# Altium schematic sheet Power Stage.SchDoc
size 431 x 279 mm; Date: Not shown in title block; ApprovedBy: Not shown in title block; CheckedBy: Not shown in title block; Author: Not shown; CompanyName: Not shown in title block; DrawnBy: Bowen; Engineer: Not shown; Organization: Not shown in title block; Address1: Not shown in title block; Address2: Not shown in title block; Address3: Not shown in title block; Address4: Not shown in title block; DocumentNumber: 1; Revision: Use project parameter SCH_Rev; SheetNumber: 1; SheetTotal: 3; PageSetup: Record=PageOptions|CenterHorizontal=True|CenterVertical=True|PrintScale=1.00|XCorrection=1.00|YCorrection=1.00|PrintKind=0|BorderSize=5000000|LeftOffset=0|BottomOffset=0|Orientation=2|PaperLength=1000|PaperWidth=1000|Scale=100|PaperSource=15|PrintQuality=600|MediaType=1|DitherType=10|PaperKind=Letter|PrintScaleMode=1; CurrentTime: Not shown in title block; CurrentDate: Not shown in title block; Time: Not shown in title block; DocumentFullPathAndName: Not shown in title block; DocumentName: Not shown in title block; ModifiedDate: 1/25/2022; ImagePath: Not shown in title block
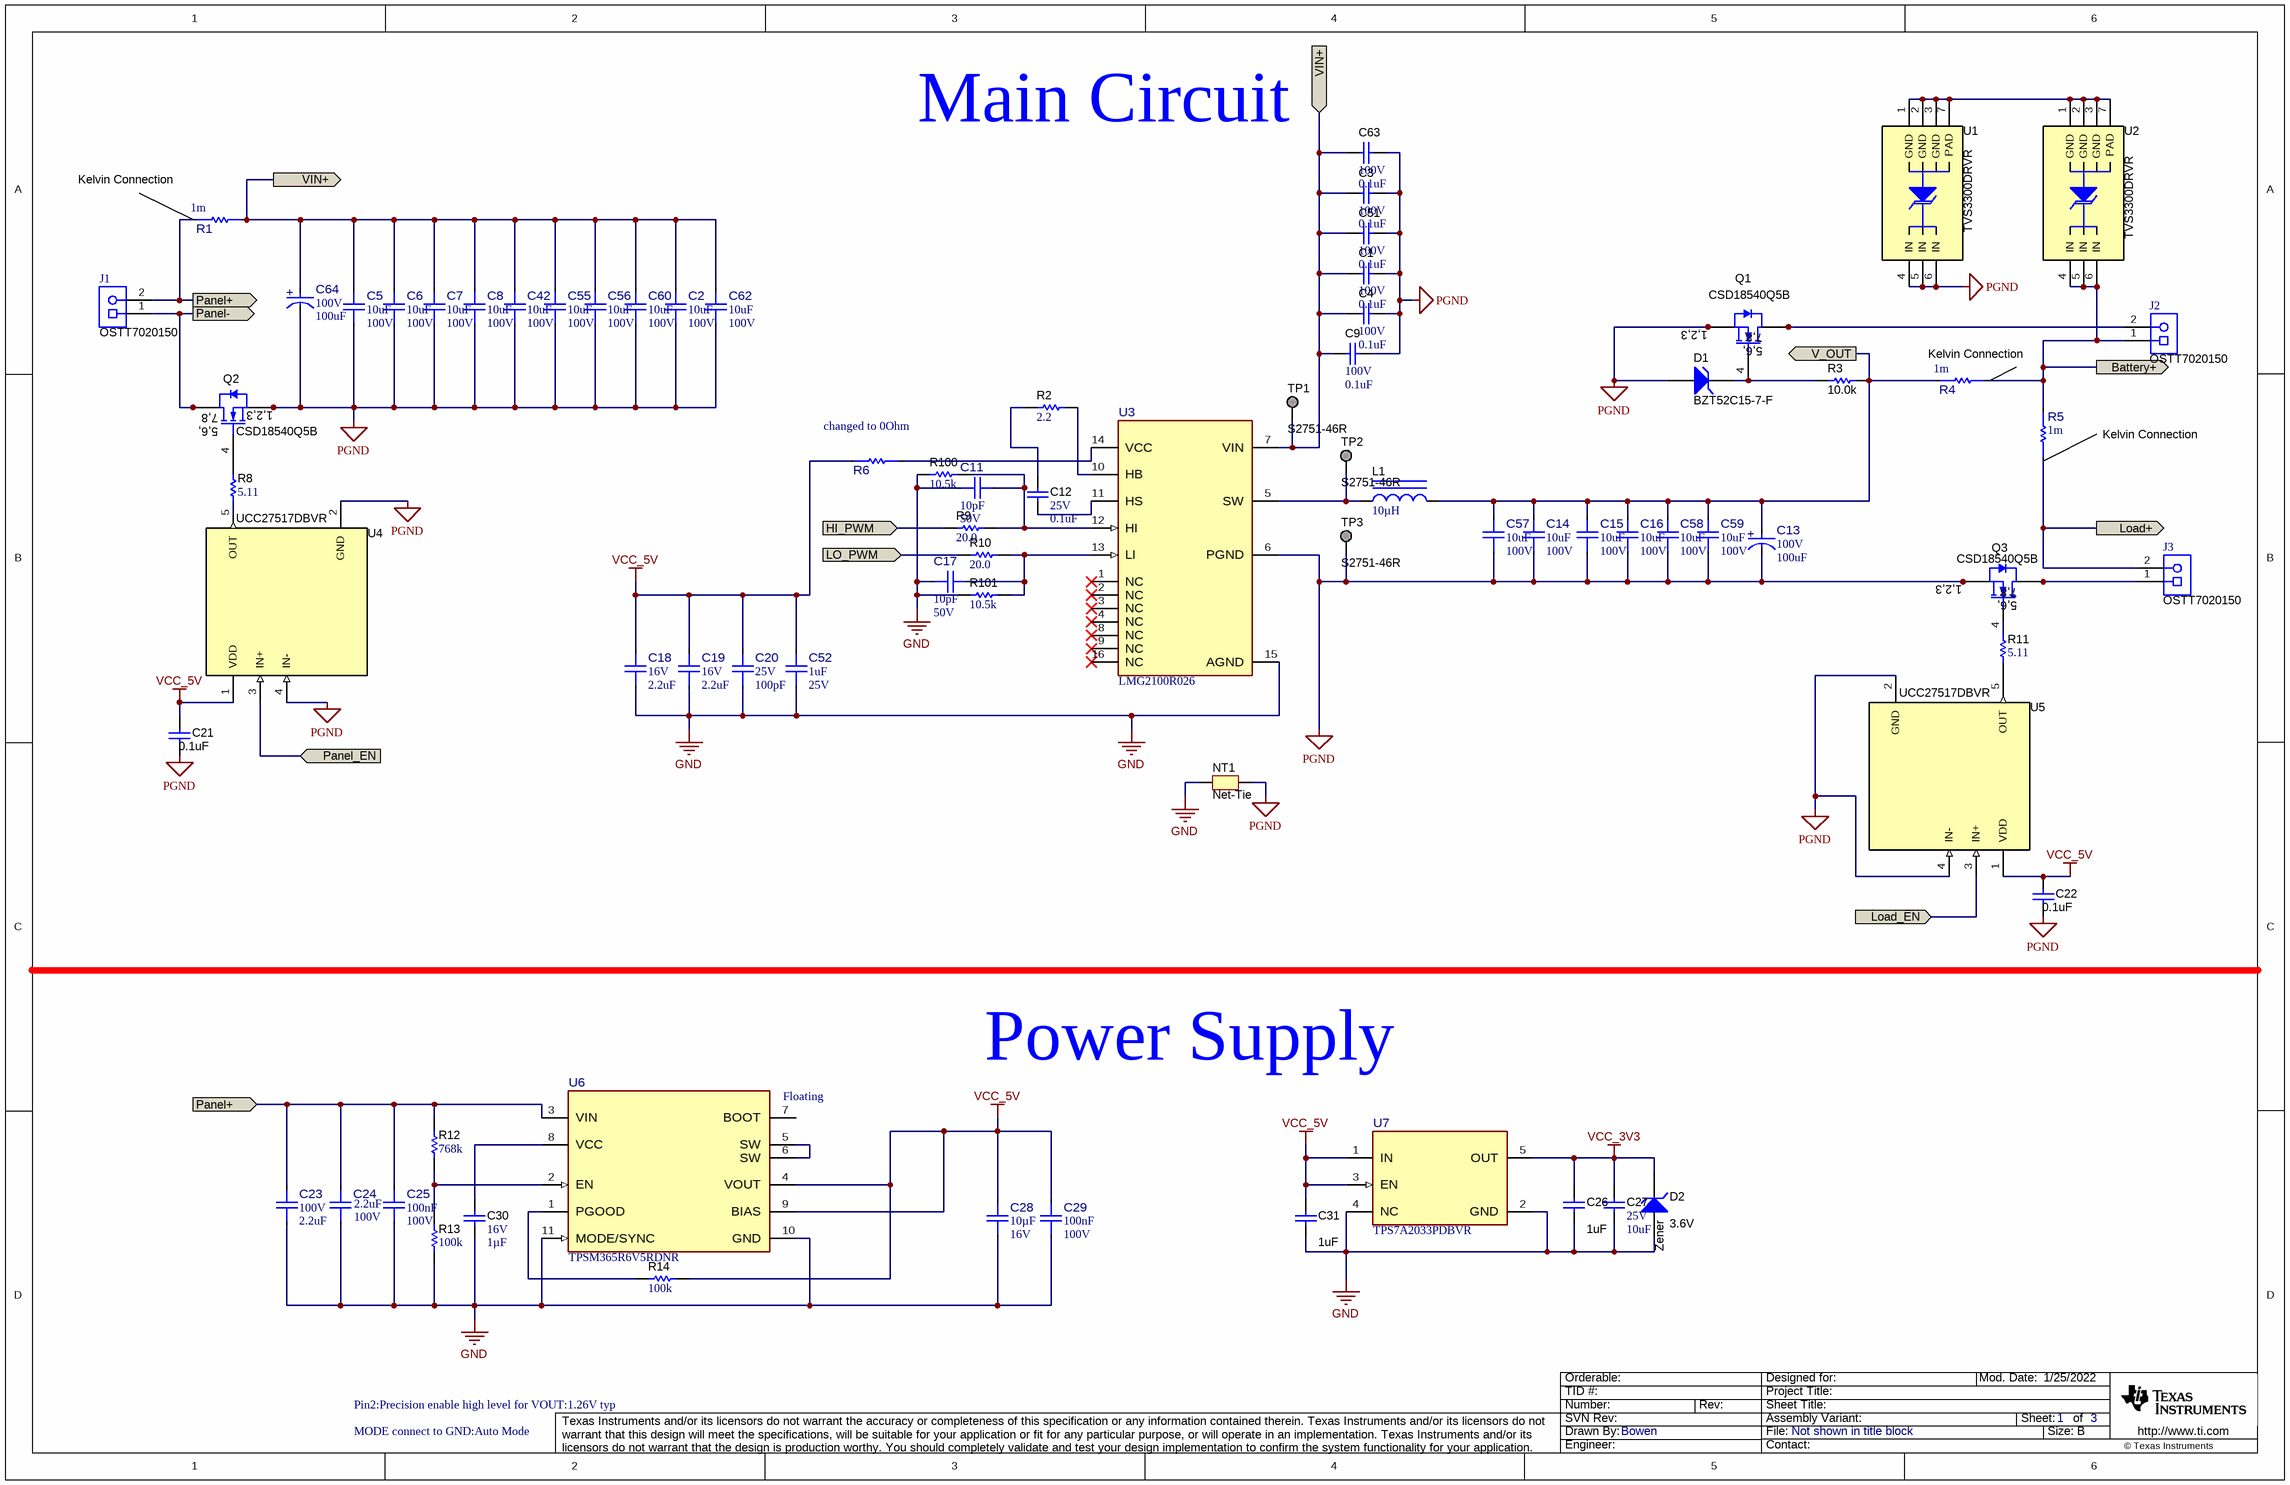
[diagram p0: Power Stage.SchDoc]

## Parts
C1  VDC_V: 100V  ValueDisplayed: 0.1uF  [0402S]  (hidden comment: GRM155R62A104KE14D)
C2  ValueDisplayed: 10uF  VDC_V: 100V  [FP-GRM32EC72A106KE05L_1210-MFG]  (hidden comment: GRM32EC72A106KE05L)
C3  VDC_V: 100V  ValueDisplayed: 0.1uF  [0402S]  (hidden comment: GRM155R62A104KE14D)
C4  VDC_V: 100V  ValueDisplayed: 0.1uF  [0402S]  (hidden comment: GRM155R62A104KE14D)
C5  ValueDisplayed: 10uF  VDC_V: 100V  [FP-GRM32EC72A106KE05L_1210-MFG]  (hidden comment: GRM32EC72A106KE05L)
C6  ValueDisplayed: 10uF  VDC_V: 100V  [FP-GRM32EC72A106KE05L_1210-MFG]  (hidden comment: GRM32EC72A106KE05L)
C7  ValueDisplayed: 10uF  VDC_V: 100V  [FP-GRM32EC72A106KE05L_1210-MFG]  (hidden comment: GRM32EC72A106KE05L)
C8  ValueDisplayed: 10uF  VDC_V: 100V  [FP-GRM32EC72A106KE05L_1210-MFG]  (hidden comment: GRM32EC72A106KE05L)
C9  VDC_V: 100V  ValueDisplayed: 0.1uF  [0402S]  (hidden comment: GRM155R62A104KE14D)
C11  ValueDisplayed: 10pF  VDC_V: 50V  [FP-04025U100FAT2A_0402-MFG]  (hidden comment: 04025U100FAT2A)
C12  VDC_V: 25V  ValueDisplayed: 0.1uF  [0402S]  (hidden comment: GRM155R71E104KE14D)
C13  VDC_V: 100V  ValueDisplayed: 100uF  [FP-ESY476M100AH1AA_RADIAL-MFG]  (hidden comment: ESY107M100AH5)
C14  ValueDisplayed: 10uF  VDC_V: 100V  [FP-GRM32EC72A106KE05L_1210-MFG]  (hidden comment: GRM32EC72A106KE05L)
C15  ValueDisplayed: 10uF  VDC_V: 100V  [FP-GRM32EC72A106KE05L_1210-MFG]  (hidden comment: GRM32EC72A106KE05L)
C16  ValueDisplayed: 10uF  VDC_V: 100V  [FP-GRM32EC72A106KE05L_1210-MFG]  (hidden comment: GRM32EC72A106KE05L)
C17  ValueDisplayed: 10pF  VDC_V: 50V  [FP-04025U100FAT2A_0402-MFG]  (hidden comment: 04025U100FAT2A)
C18  VDC_V: 16V  ValueDisplayed: 2.2uF  [FP-GRM188C71C225KE11D_0603-MFG]  (hidden comment: GRM188C71C225KE11D)
C19  VDC_V: 16V  ValueDisplayed: 2.2uF  [FP-GRM188C71C225KE11D_0603-MFG]  (hidden comment: GRM188C71C225KE11D)
C20  VDC_V: 25V  ValueDisplayed: 100pF  [FP-GRT1555C1E101JA02D_0402-MFG]  (hidden comment: GRT1555C1E101JA02D)
C21  ValueDisplayed: 0.1uF  [0603]  (hidden comment: GMK107BJ104KAHT)
C22  ValueDisplayed: 0.1uF  [0603]  (hidden comment: GMK107BJ104KAHT)
C23  VDC_V: 100V  ValueDisplayed: 2.2uF  [FP-12061C225KAT2A_1206-MFG]  (hidden comment: 12061C225KAT2A)
C24  VDC_V: 100V  ValueDisplayed: 2.2uF  [FP-12061C225KAT2A_1206-MFG]  (hidden comment: 12061C225KAT2A)
C25  Cap_F: 100nF  VDC_V: 100V  [FP-GRM188R72A104KA35D_0603-MFG]  (hidden comment: GRM188R72A104KA35D)
C26  ValueDisplayed: 1uF  [0603]  (hidden comment: C1608X7R1E105K080AB)
C27  VDC_V: 25V  ValueDisplayed: 10uF  [1206_180]  (hidden comment: GRM31CR71E106KA12L)
C28  Cap_F: 10µF  VDC_V: 16V  [FP-CL21B106KOQNNNG_0805-MFG]  (hidden comment: CL21B106KOQNNNG)
C29  Cap_F: 100nF  VDC_V: 100V  [FP-GRM188R72A104KA35D_0603-MFG]  (hidden comment: GRM188R72A104KA35D)
C30  VDC_V: 16V  Cap_F: 1µF  [0603]  (hidden comment: CL10B105KO8VPNC)
C31  ValueDisplayed: 1uF  [0603]  (hidden comment: C1608X7R1E105K080AB)
C42  ValueDisplayed: 10uF  VDC_V: 100V  [FP-GRM32EC72A106KE05L_1210-MFG]  (hidden comment: GRM32EC72A106KE05L)
C51  VDC_V: 100V  ValueDisplayed: 0.1uF  [0402S]  (hidden comment: GRM155R62A104KE14D)
C52  ValueDisplayed: 1uF  VDC_V: 25V  [FP-GRT155R61E105KE01D_0402-MFG]  (hidden comment: GRT155R61E105KE01D)
C55  ValueDisplayed: 10uF  VDC_V: 100V  [FP-GRM32EC72A106KE05L_1210-MFG]  (hidden comment: GRM32EC72A106KE05L)
C56  ValueDisplayed: 10uF  VDC_V: 100V  [FP-GRM32EC72A106KE05L_1210-MFG]  (hidden comment: GRM32EC72A106KE05L)
C57  ValueDisplayed: 10uF  VDC_V: 100V  [FP-GRM32EC72A106KE05L_1210-MFG]  (hidden comment: GRM32EC72A106KE05L)
C58  ValueDisplayed: 10uF  VDC_V: 100V  [FP-GRM32EC72A106KE05L_1210-MFG]  (hidden comment: GRM32EC72A106KE05L)
C59  ValueDisplayed: 10uF  VDC_V: 100V  [FP-GRM32EC72A106KE05L_1210-MFG]  (hidden comment: GRM32EC72A106KE05L)
C60  ValueDisplayed: 10uF  VDC_V: 100V  [FP-GRM32EC72A106KE05L_1210-MFG]  (hidden comment: GRM32EC72A106KE05L)
C62  ValueDisplayed: 10uF  VDC_V: 100V  [FP-GRM32EC72A106KE05L_1210-MFG]  (hidden comment: GRM32EC72A106KE05L)
C63  VDC_V: 100V  ValueDisplayed: 0.1uF  [0402S]  (hidden comment: GRM155R62A104KE14D)
C64  VDC_V: 100V  ValueDisplayed: 100uF  [FP-ESY476M100AH1AA_RADIAL-MFG]  (hidden comment: ESY107M100AH5)
D1  BZT52C15-7-F  [SOD-123]
D2  Zener  value 3.6V  [SOD-123]
J1  OSTT7020150  [On-Shore_OSTT7020150]
J2  OSTT7020150  [On-Shore_OSTT7020150]
J3  OSTT7020150  [On-Shore_OSTT7020150]
L1  ValueDisplayed: 10µH  [WE-HCF_2818]  (hidden comment: 7443641000)
NT1  Net-Tie  [Net-Tie_0805_HV_NoOverlay]  (net tie, no BOM)
Q1  CSD18540Q5B  [DNK0008A]
Q2  CSD18540Q5B  [DNK0008A]
Q3  CSD18540Q5B  [DNK0008A]
R1  value 1m  [FP-ULRG32512R001FLFSLT_2512-MFG]  (hidden comment: ULRG32512R001FLFSLT)
R2  ValueDisplayed: 2.2  [0402S]  (hidden comment: CRCW04022R20JNED)
R3  ValueDisplayed: 10.0k  [0603]  (hidden comment: Resistor)
R4  value 1m  [FP-ULRG32512R001FLFSLT_2512-MFG]  (hidden comment: ULRG32512R001FLFSLT)
R5  value 1m  [FP-ULRG32512R001FLFSLT_2512-MFG]  (hidden comment: ULRG32512R001FLFSLT)
R6  RCG04020000Z0ED  [FP-RCG04020000Z0ED_0402-MFG]  (value not drawn)
R8  value 5.11  [1206]  (hidden comment: CRCW12065R11FKEA)
R9  ValueDisplayed: 20.0  [0603]  (hidden comment: RC0603FR-0720RL)
R10  ValueDisplayed: 20.0  [0603]  (hidden comment: RC0603FR-0720RL)
R11  value 5.11  [1206]  (hidden comment: CRCW12065R11FKEA)
R12  ValueDisplayed: 768k  [0603]  (hidden comment: RC0603FR-07768KL)
R13  ValueDisplayed: 100k  [0603]  (hidden comment: RC0603FR-07100KL)
R14  ValueDisplayed: 100k  [0402]  (hidden comment: RC0402FR-07100KL)
R100  ValueDisplayed: 10.5k  [0402S]  (hidden comment: RC0402FR-0710K5L)
R101  ValueDisplayed: 10.5k  [0402S]  (hidden comment: RC0402FR-0710K5L)
TP1  S2751-46R  [Harwin_S2751-46R]  (no BOM)
TP2  S2751-46R  [Harwin_S2751-46R]  (no BOM)
TP3  S2751-46R  [Harwin_S2751-46R]  (no BOM)
U1  TVS3300DRVR  [DRV0006A]
U2  TVS3300DRVR  [DRV0006A]
U3  LMG2100R026  [VBN0016A-MFG]
U4  UCC27517DBVR  [DBV0005A_N]
U5  UCC27517DBVR  [DBV0005A_N]
U6  TPSM365R6V5RDNR  [RDN0011A-MFG]
U7  TPS7A2033PDBVR  [DBV0005A-MFG]

## Ports
Battery+ (out), HI_PWM (in), LO_PWM (in), Load+ (out), Load_EN (in), Panel+ (in), Panel+ (out), Panel- (out), Panel_EN (in), V_OUT (out), VIN+ (in), VIN+ (out)

## Nets
GND: C11.1 C17.1 C18.1 C19.1 C20.1 C23.1 C24.1 C25.1 C26.2 C27.2 C28.1 C29.1 C30.2 C31.2 C52.1 D2.2(A) NT1.1 R13.1 R100.2 R101.2 U3.15(AGND) U6.10(GND) U6.11(MODE/SYNC) U7.2(GND) U7.4(NC)
PGND: C1.1 C2.1 C3.1 C4.1 C5.1 C6.1 C7.1 C8.1 C9.1 C13.1(CATHODE) C14.1 C15.1 C16.1 C21.2 C22.2 C42.1 C51.1 C55.1 C56.1 C57.1 C58.1 C59.1 C60.1 C62.1 C63.1 C64.1(CATHODE) D1.2(A) NT1.2 Q1.1(S) Q1.2(S) Q1.3(S) Q2.1(S) Q2.2(S) Q2.3(S) Q3.1(S) Q3.2(S) Q3.3(S) TP3.1 U1.4(IN) U1.5(IN) U1.6(IN) U3.6(PGND) U4.2(GND) U4.4(IN-) U5.2(GND) U5.4(IN-)
VCC_3V3: C26.1 C27.1 D2.1(K) U7.5(OUT)
VCC_5V: C18.2 C19.2 C20.2 C21.1 C22.1 C28.2 C29.2 C31.1 C52.2 R6.1 R14.2 U4.1(VDD) U5.1(VDD) U6.4(VOUT) U6.9(BIAS) U7.1(IN) U7.3(EN)
Battery+: J2.1 R4.2 R5.2 U2.4(IN) U2.5(IN) U2.6(IN) ; port Battery+
HI_PWM: R9.1 ; port HI_PWM
LO_PWM: R10.1 ; port LO_PWM
Load+: J3.2 R5.1 ; port Load+
Load_EN: U5.3(IN+) ; port Load_EN
Panel+: C23.2 C24.2 C25.2 J1.2 R1.1 R12.2 U6.3(VIN) ; port Panel+
Panel-: J1.1 Q2.5(D) Q2.6(D) Q2.7(D) Q2.8(D) Q2.9(D) ; port Panel-
Panel_EN: U4.3(IN+) ; port Panel_EN
V_OUT: C13.2(ANODE) C14.2 C15.2 C16.2 C57.2 C58.2 C59.2 L1.2 R3.2 R4.1 ; port V_OUT
VIN+: C1.2 C2.2 C3.2 C4.2 C5.2 C6.2 C7.2 C8.2 C9.2 C42.2 C51.2 C55.2 C56.2 C60.2 C62.2 C63.2 C64.2(ANODE) R1.2 TP1.1 U3.7(VIN) ; port VIN+
NetC11_2: C11.2 R9.2 R100.1 U3.12(HI)
NetC12_1: C12.1 R2.1
NetC12_2: C12.2 U3.11(HS)
NetC17_2: C17.2 R10.2 R101.1 U3.13(LI)
NetC30_1: C30.1 U6.8(VCC)
NetD1_1: D1.1(K) Q1.4(G) R3.1
NetJ2_2: J2.2 Q1.5(D) Q1.6(D) Q1.7(D) Q1.8(D) Q1.9(D)
NetJ3_1: J3.1 Q3.5(D) Q3.6(D) Q3.7(D) Q3.8(D) Q3.9(D)
NetL1_1: L1.1 TP2.1 U3.5(SW)
NetQ2_4: Q2.4(G) R8.2
NetQ3_4: Q3.4(G) R11.2
NetR2_2: R2.2 U3.10(HB)
NetR6_2: R6.2 U3.14(VCC)
NetR8_1: R8.1 U4.5(OUT)
NetR11_1: R11.1 U5.5(OUT)
NetR12_1: R12.1 R13.2 U6.2(EN)
NetR14_1: R14.1 U6.1(PGOOD)
NetU1_1: U1.1(GND) U1.2(GND) U1.3(GND) U1.7(PAD) U2.1(GND) U2.2(GND) U2.3(GND) U2.7(PAD)
NetU6_5: U6.5(SW) U6.6(SW)

Not connected (* = marked no-connect by the designer): U3 1(NC)* 2(NC)* 3(NC)* 4(NC)* 8(NC)* 9(NC)* 16(NC)*; U6 7(BOOT)

## Notes on the sheet
- (near C63) Main Circuit
- (near R1) Kelvin Connection
- (near R4) Kelvin Connection
- changed to 0Ohm
- Kelvin Connection
- (near U6) Floating
- Power Supply
- Pin2:Precision enable high level for VOUT:1.26V typ
- MODE connect to GND:Auto Mode
- Drawn By:
- SVN Rev:
- Number:
- TID #:
- Orderable:
- Rev:
- Sheet Title:
- File:
- Project Title:
- Designed for:
- Assembly Variant:
- Mod. Date:
- Sheet:
- Size:
- of
- B
- http://www.ti.com
- Texas Instruments and/or its licensors do not warrant the accuracy or completeness of this specification or any information contained therein. Texas Instruments and/or its licensors do not warrant that this design will meet the specifications, will be suitable for your application or fit for any particular purpose, or will operate in an implementation. Texas Instruments and/or its licensors do not warrant that the design is production worthy. You should completely validate and test your design implementation to confirm the system functionality for your application.
- Engineer:
- Contact:
- © Texas Instruments
- (in symbol CMP-0000823-2) 7,8; 1,2,3; 5,6,
- (in symbol CMP-0093719-1) +

## Library data of the parts
C1 C3 C4 C9 C51 C63 = CMP-0006618-2: CAP, CERM, 0.1 uF, 100 V, +/- 10%, X5R, 0402; Manufacturer: MuRata; TaMin_C: -55°C; Polarized: N; SizeAreaWB_mm2: 3; Value1: Unknown; U/M: EA; Value: 0.1uF; TaMax_C: 85°C; SizeZ_mm: 0.6; SizeX_mm: 1; SizeY_mm: 0.5; Cap_Case: 0402; Cap_F: 100nF; AEC Category: Q200; Supplier Part Number 2: 96Y9228; Publisher: Texas Instruments; Supplier 2: Newark; Supplier Part Number 3: 81-GRM155R62A104KE4D; TempCo: X5R; Supplier 3: Mouser; Published: 2008-06-19; RoHS: Y; MountType: SMT; Supplier 1: Digi-Key; PackageReference: 0402; Tolerance_%: 10%; Value2: 100V; SizeArea_mm2: 0.5; CompType: Capacitor; LatestRevisionDate: 2017-03-09; PartNumber: GRM155R62A104KE14D; AEC Qualified: N; ComponentLink1Description: Datasheet link; AEC Grade: N/A; Supplier Part Number 1: 490-10458-1-ND; Technology: Ceramic; ComponentLink1URL: http://psearch.en.murata.com/capacitor/product/GRM155R62A104KE14%23.pdf
C2 C5-C8 C14-C16 C42 C55-C60 C62 = CMP-0087970-1: 10µF ±10% 100V Ceramic Capacitor X7S 1210 (3225 Metric); Manufacturer: Murata; Symbol Name: SYM-GRM32EC72A106KE05L; Tolerance_%: 0.1; AEC Qualified: No; TempCo: 22%; SizeZ_mm: 2.7mm; RoHS: TRUE; ComponentLink1Description: Datasheet; ComponentLink1URL: https://search.murata.co.jp/Ceramy/image/img/A01X/G101/ENG/GRM32EC72A106KE05-01A.pdf; PackageReference: 1210; PartNumber: GRM32EC72A106KE05L; Cap_F: 10µF
C11 C17 = CMP-0097874-1: 10 pF ±1% 50V Ceramic Capacitor C0G, NP0 0402 (1005 Metric); Manufacturer: KYOCERA AVX; TempCo: 30ppm/°C; AEC Qualified: No; Value: 10pF; SizeZ_mm: 0.6mm; Part Number: 04025U100FAT2A; Temperature Characteristic: C0G; ComponentLink1URL: https://datasheets.kyocera-avx.com/U-Series.pdf; Mouser Description: Multilayer Ceramic Capacitors MLCC - SMD/SMT 50V 10pF C0G 0402 1%; Supplier 2: Mouser; Tolerance_%: 1%; ComponentLink1Description: Datasheet; Operating Temperature Range: -55°C to +125°C; Supplier Part Number 1: 478-5717-1-ND; Lead Free: Yes; Digikey Description: CAP CER 10PF 50V C0G/NP0 0402; RoHS: TRUE; Digikey Part Number: 478-5717-1-ND; Mouser Part Number: 581-04025U100FAT2A; Supplier 1: Digikey; Datasheet Path: datasheets/Cap-04025U100FAT2A.pdf; helpURL: https://upverter.com/upn/revision/fd3ee14ffddf53e3/; PackageReference: 0402; PartNumber: 04025U100FAT2A; datasheet: https://datasheets.kyocera-avx.com/U-Series.pdf; Cap_F: 10pF; Supplier Part Number 2: 581-04025U100FAT2A
C12 = CMP-0006659-2: CAP, CERM, 0.1 uF, 25 V, +/- 10%, X7R, 0402; Manufacturer: MuRata; TaMin_C: -55°C; Polarized: N; SizeAreaWB_mm2: 3; Value1: Unknown; U/M: EA; Value: 0.1uF; TaMax_C: 125°C; SizeZ_mm: 0.6; SizeX_mm: 1; SizeY_mm: 0.5; Cap_Case: 0402; Cap_F: 100nF; AEC Category: Q200; Supplier Part Number 2: 31Y1751; Publisher: Texas Instruments; Supplier 2: Newark; Supplier Part Number 3: 81-GRM155R71E104KE4D; TempCo: X7R; Supplier 3: Mouser; Published: 2008-06-19; RoHS: Y; MountType: SMT; Supplier 1: Digi-Key; PackageReference: 0402; Tolerance_%: 10%; Value2: 25V; SizeArea_mm2: 0.5; CompType: Capacitor; LatestRevisionDate: 2017-03-09; PartNumber: GRM155R71E104KE14D; AEC Qualified: N; ComponentLink1Description: Datasheet link; AEC Grade: N/A; Supplier Part Number 1: 490-10698-1-ND; Technology: Ceramic; ComponentLink1URL: http://search.murata.co.jp/Ceramy/image/img/A01X/G101/ENG/GRM155R71E104KE14-01.pdf
C13 C64 = CMP-0093719-1: 100 µF 100 V Aluminum Electrolytic Capacitors Radial, Can 180mOhm @ 100kHz 4000 Hrs @ 105°C; Part Number: ESY476M100AH1AA; Manufacturer: Kemet; SizeZ_mm: 13.5mm; Value: 100µF; Dissipation Factor: 8%; Cap_F: 47µF; IRMS_A: 450mA; Tolerance_%: 20%; AEC Qualified: No; Life: 4000Hours; Esr: 0.24; Leakage Current: 47uA; Supplier 2: Mouser; Digikey Part Number: 399-6643-ND; Operating Temperature Range: -40°C to +105°C; ComponentLink1Description: Datasheet; PartNumber: ESY476M100AH1AA; RoHS: TRUE; ComponentLink1URL: https://api.kemet.com/component-edge/download/specsheet/ESY476M100AH1AA.pdf; Digikey Description: CAP ALUM 47UF 20% 100V RADIAL; Datasheet Path: datasheets/Cap-ESY476M100AH1AA.pdf; Mouser Description: Aluminum Electrolytic Capacitors - Leaded 100volts 47uF 20%; datasheet: https://api.kemet.com/component-edge/download/specsheet/ESY476M100AH1AA.pdf; Supplier 1: Digikey; helpURL: https://upverter.com/upn/revision/6e76b35d52307b40/; Supplier Part Number 1: 399-6643-ND; Mouser Part Number: 80-ESY476M100AH1AA; PackageReference: RADIAL; Lead Free: Yes; Supplier Part Number 2: 80-ESY476M100AH1AA
C18 C19 = CMP-0089452-2: 2.2µF ±10% 16V Ceramic Capacitor X7S 0603 (1608 Metric); Manufacturer: Murata; SizeZ_mm: 1mm; Value: 2.2uF; AEC Qualified: No; TempCo: 22%; helpURL: https://upverter.com/upn/revision/8b71f5ea9499401b/; Supplier 1: Digikey; Part Number: GRM188C71C225KE11D; Supplier Part Number 1: 490-12731-1-ND; ComponentLink1Description: Datasheet; ComponentLink1URL: https://search.murata.co.jp/Ceramy/image/img/A01X/G101/ENG/GRM188C71C225KE11-01A.pdf; Lead Free: Yes; Digikey Description: CAP CER 2.2UF 16V X7S 0603; Cap_F: 2.2µF; PartNumber: GRM188C71C225KE11D; Digikey Part Number: 490-12731-1-ND; Operating Temperature Range: -55°C to +125°C; Tolerance_%: 10%; Supplier Part Number 2: 81-GRM188C71C225KE1D; RoHS: TRUE; PackageReference: 0603; Mouser Description: Cap Ceramic 2.2uF 16V X7S 10% SMD 0603 125°C Paper T/R; Mouser Part Number: 81-GRM188C71C225KE1D; Temperature Characteristic: X7S; datasheet: https://search.murata.co.jp/Ceramy/image/img/A01X/G101/ENG/GRM188C71C225KE11-01A.pdf; Datasheet Path: datasheets/Cap-GRM188C71C225KE11D.pdf; Supplier 2: Mouser
C20 = CMP-0096845-1: Multi-Layer Ceramic Capacitor 100pF 25V C0G ±5% 0402 Paper T/R; Manufacturer: Murata; AEC Qualified: Yes; AEC Grade: Grade 1; TempCo: 30ppm/°C; SizeZ_mm: 0.55mm; Operating Temperature Range: -55°C to +125°C; Datasheet Path: datasheets/Cap-GRT1555C1E101JA02D.pdf; Part Number: GRT1555C1E101JA02D; Temperature Characteristic: C0G; PackageReference: 0402; Tolerance_%: 5%; Value: 100pF; helpURL: https://upverter.com/upn/revision/11416c75d0d1ded0/; ComponentLink1URL: https://www.murata.com/en-us/products/productdetail?partno=GRT1555C1E101JA02%23; Lead Free: Yes; Cap_F: 100pF; ComponentLink1Description: Datasheet; RoHS: TRUE; datasheet: https://www.murata.com/en-us/products/productdetail?partno=GRT1555C1E101JA02%23; PartNumber: GRT1555C1E101JA02D
C21 C22 = CMP-0007044-5: CAP CER 0.1UF 25V X5R 0603; Manufacturer: Taiyo Yuden; PartNumber: TMK107BJ104KA-T; TaMin_C: -55°C; ESR_ohm: 0.0296; Polarized: N; TempCo: X7R; SizeAreaWB_mm2: 4.68; Value1: 0.0296 ohm; U/M: EA; TaMax_C: 125°C; Tolerance_%: 10%; SizeZ_mm: 1; SizeX_mm: 1.6; SizeY_mm: 0.8; SizeArea_mm2: 1.28; CompType: Capacitor; Cap_F: 100nF; IRMS_A: 9.7199dA; AEC Category: Q200; Publisher: Texas Instruments; Published: 2008-06-19; RoHS: Y; MountType: SMT; Value: 0.1uF; Supplier 1: Digi-Key; PackageReference: 0603; Cap_Case: 0603; Value2: 25V; LatestRevisionDate: 2017-03-09; AEC Qualified: N; VDC_V: 25V; ComponentLink1Description: Datasheet link; AEC Grade: N/A; Supplier Part Number 1: 587-1245-1-ND; Technology: Ceramic; ComponentLink1URL: https://product.tdk.com/en/search/capacitor/ceramic/mlcc/info?part_no=C1608X7R1H104K080AA
C23 C24 = CMP-0092494-1: 2.2uF @ ±10% 100V Ceramic Capacitor X7R 15% 1206 (3216 Metric); Manufacturer: AVX; SizeZ_mm: 1.78mm; AEC Qualified: No; Value: 2.2µF; Lead Free: Yes; ComponentLink1Description: Datasheet; Digikey Part Number: 478-10860-1-ND; Datasheet Path: datasheets/Cap-12061C225KAT2A.pdf; Part Number: 12061C225KAT2A; Supplier Part Number 2: 581-12061C225KAT2A; Mouser Part Number: 581-12061C225KAT2A; Tolerance_%: 10%; PackageReference: 1206; Supplier Part Number 1: 478-10860-1-ND; Mouser Description: Multilayer Ceramic Capacitors MLCC - SMD/SMT 100V 2.2uF X7R 1206 10% Tol; TempCo: 15%; ComponentLink1URL: https://spicat.avx.com/product/mlcc/chartview/12061C225KAT2A/DataSheet/X7R; Cap_F: 2.2µF; Supplier 1: Digikey; Temperature Characteristic: X7R; Digikey Description: CAP CER 2.2UF 100V X7R 1206; helpURL: https://upverter.com/upn/revision/7b54935363ae11bc/; PartNumber: 12061C225KAT2A; RoHS: TRUE; Operating Temperature Range: -55°C to +125°C; Supplier 2: Mouser; datasheet: https://spicat.avx.com/product/mlcc/chartview/12061C225KAT2A/DataSheet/X7R
C25 C29 = CMP-0088837-1: 0.1µF ±10% 100V Ceramic Capacitor X7R 0603 (1608 Metric); Manufacturer: Murata; AEC Qualified: No; Import Ts: 1521862704; TempCo: 15%; Ciiva Ids: 120189; ValueDisplayed: 0.1uF; SizeZ_mm: 0.9mm; Temperature Characteristic: X7R; Mouser Description: Capacitor 0.1 uF 100 Volt X7R 10% Surface Mount 0603 Paper Tape and Reel; Device Class L2: Capacitors; Datasheet Path: datasheets/Cap-GRM188R72A104KA35D.pdf; Release Date: 1469158904; Lead Free: Yes; RoHS: TRUE; helpURL: https://upverter.com/upn/revision/ce457beaf9590272/; ComponentLink1URL: http://search.murata.co.jp/Ceramy/image/img/A01X/G101/ENG/GRM188R72A104KA35-01.pdf; Supplier Part Number 2: 81-GRM188R72A104KA35; Part Number: GRM188R72A104KA35D; Operating Temperature Range: -55°C to +125°C; PartNumber: GRM188R72A104KA35D; Supplier Part Number 1: 490-3285-1-ND; Supplier 2: Mouser; Device Class L1: Passive Components; ComponentLink1Description: Datasheet; PackageReference: 0603; Tolerance_%: 10%; datasheet: http://search.murata.co.jp/Ceramy/image/img/A01X/G101/ENG/GRM188R72A104KA35-01.pdf; Device Class L3: Ceramic Capacitors; Supplier 1: Digikey; Digikey Part Number: 490-3285-1-ND; Digikey Description: CAP CER 0.1UF 100V X7R 0603; Vault Guid: B89309C6-303D-441B-926C-6D1F82BE1DD2; Mouser Part Number: 81-GRM188R72A104KA35
C26 C31 = CMP-0006831-4: CAP CER 1UF 16V Y5V 0603; Manufacturer: Yageo; PartNumber: CC0603MRY5V7BB105; TaMin_C: -55°C; Polarized: N; TempCo: X7R; SizeAreaWB_mm2: 4.68; Value1: Unknown; U/M: EA; TaMax_C: 125°C; Tolerance_%: 10%; SizeZ_mm: 1; SizeX_mm: 1.6; SizeY_mm: 0.8; SizeArea_mm2: 1.28; CompType: Capacitor; Cap_F: 1µF; AEC Category: Q200; Publisher: Texas Instruments; Published: 2008-06-19; RoHS: Y; MountType: SMT; Value: 1uF; Supplier 1: Digi-Key; PackageReference: 0603; Cap_Case: 0603; Value2: 16V; LatestRevisionDate: 2017-03-09; AEC Qualified: N; VDC_V: 16V; ComponentLink1Description: Datasheet link; AEC Grade: N/A; Supplier Part Number 1: 311-3414-1-ND; Technology: Ceramic; ComponentLink1URL: http://katalog.we-online.de/pbs/datasheet/885012206052.pdf
C27 = CMP-0008965-2: CAP, CERM, 10 uF, 25 V, +/- 10%, X7R, 1206; Manufacturer: MuRata; TaMin_C: -55°C; Polarized: N; SizeAreaWB_mm2: 10.92; Value1: Unknown; U/M: EA; Value: 10uF; TaMax_C: 125°C; SizeZ_mm: 1.8; SizeX_mm: 3.2; SizeY_mm: 1.6; Cap_Case: 2220; SizeArea_mm2: 5.12; Cap_F: 10µF; AEC Category: Q200; Supplier Part Number 2: 1828837; Publisher: Texas Instruments; Supplier 2: Farnell; TempCo: X7R; Published: 2008-06-19; RoHS: Y; MountType: SMT; Supplier 1: Mouser; PackageReference: 1206; Tolerance_%: 10%; Value2: 25V; CompType: Capacitor; LatestRevisionDate: 2017-03-09; PartNumber: GRM31CR71E106KA12L; AEC Qualified: ?; ComponentLink1Description: Datasheet link; Supplier Part Number 1: 81-GRM31CR71E106KA12; Technology: Ceramic; ComponentLink1URL: http://search.murata.co.jp/Ceramy/PnsearchViewAction.do?HnOFG=ON&HnNFG=ON&SEL_CNT=50&sLang=en&sKey=GRM31CR71E106KA12L&x=9&y=9&search=startwith
C28 = CMP-0088847-1: Cap Ceramic 10uF 16V X7R 10% Pad SMD 0805 125°C T/R; Manufacturer: Samsung Electro-Mechanics; AEC Qualified: No; SizeZ_mm: 1.4mm; TempCo: 15%; Digikey Description: CAP CER 10UF 16V X7R 0805; PackageReference: 0805; PartNumber: CL21B106KOQNNNG; Supplier Part Number 1: 1276-6472-1-ND; Part Number: CL21B106KOQNNNG; Supplier 1: Digikey; Tolerance_%: 10%; Operating Temperature Range: -55°C to +125°C; Temperature Characteristic: X7R; Device Class L3: Ceramic Capacitors; ComponentLink1Description: Datasheet; RoHS: TRUE; Device Class L2: Capacitors; ComponentLink1URL: http://product.samsungsem.com/mlcc/CL21B106KOQNNN.do; datasheet: http://product.samsungsem.com/mlcc/CL21B106KOQNNN.do; helpURL: https://upverter.com/upn/revision/e039180d9ed05bfb/; Datasheet Path: datasheets/Cap-CL21B106KOQNNNG.pdf; Digikey Part Number: 1276-6472-1-ND; Lead Free: Yes; Device Class L1: Passive Components; ValueDisplayed: 10uF
C30 = CMP-0085302-1: CAP, CERM, 1 µF, 16 V,+/- 10%, X7R, AEC-Q200 Grade 1, 0603; Manufacturer: Samsung Electro-Mechanics; TaMax_C: 125°C; AEC Grade: 1; SizeAreaWB_mm2: 4.68; AEC Category: Q200; SizeY_mm: 0.8; U/M: EA; SizeArea_mm2: 1.28; TaMin_C: -55°C; Value: 1uF; SizeX_mm: 1.6; AEC Qualified: Y; Polarized: N; PartNumber: CL10B105KO8VPNC; Tolerance_%: 10%; PackageReference: 0603; Value2: 16V; MountType: SMT; ComponentLink1URL: http://www.samsungsem.com/kr/support/product-search/mlcc/__icsFiles/afieldfile/2018/05/28/CL10B105KO8VPNC.pdf; SizeZ_mm: 1; Technology: Ceramic; Cap_Case: 0603; ValueDisplayed: 1µF; CompType: Capacitor; RoHS: Y; ComponentLink1Description: Datasheet link; TempCo: X7R
C52 = CMP-0096975-1: Multi-Layer Ceramic Capacitor 1uF 25V X5R ±10% 0402 Paper T/R; Manufacturer: Murata; SizeZ_mm: 0.55mm; Value: 1µF; AEC Grade: Grade 3; AEC Qualified: Yes; TempCo: 0.15; PartNumber: GRT155R61E105KE01D; PackageReference: 0402; Temperature Characteristic: X5R; ComponentLink1URL: https://www.murata.com/en-us/products/productdetail?partno=GRT155R61E105KE01%23; RoHS: TRUE; Part Number: GRT155R61E105KE01D; Tolerance_%: 10%; Operating Temperature Range: -55°C to +85°C; Datasheet Path: datasheets/Cap-GRT155R61E105KE01D.pdf; Cap_F: 1µF; Lead Free: Yes; datasheet: https://www.murata.com/en-us/products/productdetail?partno=GRT155R61E105KE01%23; ComponentLink1Description: Datasheet; helpURL: https://upverter.com/upn/revision/06d788cea0f8a602/
D1 = CMP-0005768-2: Diode, Zener, 15 V, 370 mW, AEC-Q101, SOD-123; Manufacturer: Diodes Inc.; Power_W: 370mW; SizeAreaWB_mm2: 13.095; Vz_V: 15V; Value1: 0.37W; RJA_CperW: 338; U/M: EA; Value: 15V; SizeZ_mm: 1.35; SizeX_mm: 3.85; SizeY_mm: 1.7; SizeArea_mm2: 6.545; AEC Qualified: Y; AEC Category: Q101; Supplier Part Number 2: 12T1445; Publisher: Texas Instruments; Supplier 2: Newark; Supplier Part Number 3: 621-BZT52C15-F; Supplier 3: Mouser; Published: 2008-10-08; RoHS: Y; MountType: SMT; Supplier 1: Digi-Key; LatestRevisionNote: Updated Supplier Data; PackageReference: SOD-123; CompType: Zener; LatestRevisionDate: 2017-03-09; PartNumber: BZT52C15-7-F; ComponentLink1Description: Datasheet link; Supplier Part Number 1: BZT52C15-FDICT-ND; ComponentLink1URL: http://www.diodes.com/_files/datasheets/ds18004.pdf
D2 = CMP-0005782-1: Diode, Zener, 3.6 V, 500 mW, SOD-123; PartNumber: MMSZ4685T1G; Manufacturer: ON Semiconductor; U/M: EA; Power_W: 500mW; Value1: 0.5W; RJA_CperW: 340; SizeAreaWB_mm2: 13.095; SizeArea_mm2: 6.545; SizeX_mm: 3.85; SizeY_mm: 1.7; SizeZ_mm: 1.35; AEC Category: Q101; PackageReference: SOD-123; CompType: Zener; Vz_V: 3.6V; MountType: SMT; RoHS: Y; ComponentLink1Description: Datasheet link; ComponentLink1URL: http://www.onsemi.com/pub_link/Collateral/MMSZ4678T1-D.PDF; Published: 2008-10-08; Publisher: Texas Instruments; LatestRevisionDate: 2017-03-09; LatestRevisionNote: Updated Supplier Data; Supplier 1: Digi-Key; Supplier Part Number 1: MMSZ4685T1GOSCT-ND; Supplier 2: Mouser; Supplier Part Number 2: 863-MMSZ4685T1G; Supplier 3: Farnell; Supplier Part Number 3: 1651592; AEC Qualified: ?
J1-J3 = CMP-0075360-1: Terminal Block, 6.35mm, 2x1, TH; Manufacturer: On-Shore Technology; CNHeader: False; Current_A: 30A; Gender: Female; Cert_CULUS: Y; Voltage_V: 300V; Row_Count: 1; Pitch_mm: 6.35; CT: True; ComponentLink1URL: http://www.on-shore.com/wp-content/uploads/2015/09/OSTT7XX0150.pdf; Publisher: Texas Instruments; Color: Green; RoHS: Y; MountType: TH; Supplier 1: Digi-Key; PackageReference: On-Shore_OSTT7020150; PinCount: 2; CompType: Terminal Block; LatestRevisionDate: 2017-07-12; PartNumber: OSTT7020150; Orientation: R/A; ComponentLink1Description: Datasheet URL; Supplier Part Number 1: ED2675-ND; Cert_UL: Y
L1 = CMP-0086005-1: Inductor, Shielded, Ferrite, 10 µH, 30 A, 0.0024 ohm, SMD; Manufacturer: Wurth Elektronik; Irms: 30A @ 50C rise; SizeZ_mm: 18.5; AEC Qualified: N; Value: 10uH; SizeY_mm: 19.5; AEC Category: Q200; Isat: 37A @ 30% inductance drop; SizeArea_mm2: 555.75; SizeAreaWB_mm2: 655.75; SizeX_mm: 28.5; Value2: 30A; DCR_ohm: 2.4m; Technology: Shielded; MountType: SMT; CompType: Inductor; Value1: 0.0024 ohm; Ind_H: 10µH; RoHS: Y; PartNumber: 7443641000; ComponentLink1URL: https://katalog.we-online.de/pbs/datasheet/7443641000.pdf; Material: Ferrite; PackageReference: 28.5x19.5mm; Imax_A: 30A; AEC Grade: N/A; ComponentLink1Description: Datasheet link
NT1 = CMP-0078142-6: Single point connection between nets.; Library Reference: Net-Tie; Manufacturer: N/A; CompType: Net-Tie; PartNumber: N/A; MountType: SMT; PackageReference: N/A
Q1-Q3 = CMP-0000823-2: MOSFET, N-CH, 60 V, 100 A, DNK0008A (VSON-CLIP-8); Alternate Manufacturer: None; Manufacturer: Texas Instruments; SizeZ_mm: 1; ChType: N; Value2: 41 nC; Value1: 0.003; VdsMax_V: 60V; SizeX_mm: 6; SizeY_mm: 5; Vgs_V: 20V; Value: 60V; Rdson45_ohm: 3.3m; SizeArea_mm2: 30; AEC Category: Q101; IdsMax_A: 100A; SizeAreaWB_mm2: 56; U/M: EA; QgTyp_nC: 41; Supplier 2: Mouser; Supplier 1: Digi-Key; Supplier Part Number 1: 296-41076-1-ND; Supplier Part Number 2: 595-CSD18540Q5B; PartNumber: CSD18540Q5B; ComponentLink1Description: Datasheet link; ComponentLink1URL: http://www.ti.com/lit/ds/symlink/csd18540q5b.pdf; CompType: MOSFET; PackageReference: DNK0008A; AEC Qualified: N; RoHS: Y; MountType: SMT
R1 R4 R5 = CMP-0042666-1: Res Metal Strip 2512 0.001 Ohm 1% 3W ±50ppm/C Pad SMD Automotive T/R; Manufacturer: TT Electronics; AEC Grade: Grade 0; AEC Qualified: Yes; SizeZ_mm: 0.8mm; TempCo: 50ppm/°C; TaMax_C: +170°C; TaMin_C: -55°C; PackageReference: 2512; PartNumber: ULRG32512R001FLFSLT; Power_W: 3W; Res_ohm: 1m; RoHS: TRUE; Supplier 2: Mouser; Supplier Part Number 2: 66-ULRG3R001FLFSLT; Technology: Metal Element; Tolerance_%: 1%; Part Number: ULRG32512R001FLFSLT; datasheet: https://www.ttelectronics.com/TTElectronics/media/ProductFiles/Datasheet/ULR.pdf; Datasheet Path: datasheets/Res-ULRG32512R001FLFSLT.pdf; helpURL: https://upverter.com/upn/revision/2cecd2d5353825d7/; Lead Free: Yes; Mouser Part Number: 66-ULRG3R001FLFSLT; Operating Temperature Range: to; Series: ULR; ComponentLink1Description: Datasheet; ComponentLink1URL: https://www.ttelectronics.com/TTElectronics/media/ProductFiles/Datasheet/ULR.pdf
R2 = CMP-0026898-3: RES, 2.2, 5%, 0.063 W, AEC-Q200 Grade 0, 0402; Manufacturer: Vishay-Dale; Power_W: 63mW; TempCo: 200 ppm/C; Value_Code: 2R20; Value: 2.2; EIA_Code: E24; SizeX_mm: 1; SizeY_mm: 0.5; SizeZ_mm: 0.6; Value2: 0.063W; AEC Qualified: Y; VDC_V: 50V; AEC Category: Q200; AEC Grade: 0; Supplier Part Number 2: 59M6713; Supplier 2: Newark; Supplier Part Number 3: 71-CRCW0402J-2.2-E3; Supplier 3: Mouser; RoHS: E; Value1: 5%; MountType: SMT; Supplier 1: Digi-Key; PackageReference: 0402; Tolerance_%: 5%; Res_ohm: 2.2; SizeArea_mm2: 0.5; CompType: Resistor; PartNumber: CRCW04022R20JNED; ComponentLink1Description: Datasheet link; Supplier Part Number 1: 541-2.2JCT-ND; Technology: Thick Film; ComponentLink1URL: http://www.vishay.com/docs/20035/dcrcwe3.pdf
R3 = CMP-0023404-3: RES, 10.0 k, 0.1%, 0.1 W, 0603; PartNumber: RG1608P-103-B-T5; Manufacturer: Susumu Co Ltd; Value: 10.0k; Res_ohm: 10k; Value_Code: 10k0; Power_W: 100mW; Value2: 0.1W; VDC_V: 75V; TempCo: 25 ppm/C; SizeArea_mm2: 1.28; SizeX_mm: 1.6; SizeY_mm: 0.8; SizeZ_mm: 1; EIA_Code: E192; U/M: EA; AEC Category: Q200; CompType: Resistor; PackageReference: 0603; RoHS: Y; Tolerance_%: 0.1%; Value1: 0.1%; MountType: SMT; Technology: Metal Film; Published: 2008-06-26; Publisher: Texas Instruments; LatestRevisionDate: 2017-03-09; ComponentLink1Description: Datasheet link; ComponentLink1URL: http://www.susumu.co.jp/english/pdf/products-j01-01.pdf; Supplier 1: Digi-Key; Supplier Part Number 1: RG16P10.0KBCT-ND; Supplier 2: Mouser; Supplier Part Number 2: 754-RG1608P-103-B-T5; Supplier 3: Farnell; Supplier Part Number 3: 1797079; AEC Qualified: ?
R6 = CMP-0097912-1: Res Thick Film 0402 0 Ohm 1/16W Molded SMD; Manufacturer: Vishay Dale; Value: 0; Power_W: 63mW; SizeZ_mm: 0.4mm; AEC Qualified: No; VDC_V: 50V; PackageReference: 0402; Mouser Description: Thick Film Resistors - SMD ZERO OHM JUMPER 1/16watt; ComponentLink1URL: https://www.vishay.com/docs/20047/rcge3.pdf; ComponentLink1Description: Datasheet; Series: RCG e3; Supplier Part Number 1: 541-1887-1-ND; Supplier 1: Digikey; datasheet: https://www.vishay.com/docs/20047/rcge3.pdf; Technology: Thick Film; Part Number: RCG04020000Z0ED; Operating Temperature Range: -55°C to +155°C; Lead Free: Yes; Datasheet Path: datasheets/Res-RCG04020000Z0ED.pdf; Mouser Part Number: 71-RCG04020000Z0ED; helpURL: https://upverter.com/upn/revision/a560b4e12427917f/; RoHS: TRUE; Digikey Part Number: 541-1887-1-ND; Digikey Description: RES SMD 0 OHM JUMPER 1/16W 0402; PartNumber: RCG04020000Z0ED; Supplier Part Number 2: 71-RCG04020000Z0ED; Supplier 2: Mouser; Res_ohm: 0
R8 R11 = CMP-0017092-3: RES, 5.11, 1%, 0.25 W, AEC-Q200 Grade 0, 1206; Manufacturer: Vishay-Dale; Power_W: 250mW; TempCo: 100 ppm/C; Value_Code: 5R11; EIA_Code: E96; SizeX_mm: 3.2; SizeY_mm: 1.6; SizeZ_mm: 1.35; Value2: 0.25W; SizeArea_mm2: 5.12; AEC Qualified: Y; VDC_V: 200V; AEC Category: Q200; CompType: Resistor; AEC Grade: 0; Supplier Part Number 2: 71-CRCW12065R11FKEA; Supplier 2: Mouser; RoHS: E; Value1: 1%; MountType: SMT; Supplier 1: Digi-Key; PackageReference: 1206; Tolerance_%: 1%; Res_ohm: 5.11; PartNumber: CRCW12065R11FKEA; ComponentLink1Description: Datasheet link; Supplier Part Number 1: 541-5.11FFCT-ND; Technology: Thick Film; ValueDisplayed: 5.11; ComponentLink1URL: http://www.vishay.com/docs/20035/dcrcwe3.pdf
R9 R10 = CMP-0022908-4: RES, 20.0, 1%, 0.1 W, 0603; Manufacturer: Yageo; Power_W: 100mW; TempCo: 100 ppm/C; Value_Code: 20R0; Value: 20.0; EIA_Code: E96; Res_ohm: 20; SizeX_mm: 1.6; SizeY_mm: 0.8; SizeZ_mm: 1; Value2: 0.1W; SizeArea_mm2: 1.28; AEC Qualified: N; VDC_V: 75V; AEC Category: Q200; SizeAreaWB_mm2: 4.68; ComponentLink1URL: http://www.yageo.com/pdf/Pu-RC0603_51_PbFree_L_2.pdf; Supplier Part Number 2: 603-RC0603FR-0720RL; Supplier 2: Mouser; Supplier Part Number 3: 1799333; Supplier 3: Farnell; RoHS: Y; Value1: 1%; MountType: SMT; Supplier 1: Digi-Key; PackageReference: 0603; Tolerance_%: 1%; CompType: Resistor; PartNumber: RC0603FR-0720RL; ComponentLink1Description: Datasheet link; Supplier Part Number 1: 311-20.0HRCT-ND; Technology: Thick Film; AEC Grade: N/A
R12 = CMP-0023269-4: RES, 768 k, 1%, 0.1 W, 0603; Manufacturer: Yageo; Power_W: 100mW; TempCo: 100 ppm/C; Value: 768k; EIA_Code: E96; SizeX_mm: 1.6; SizeY_mm: 0.8; SizeZ_mm: 1; Value2: 0.1W; SizeArea_mm2: 1.28; AEC Qualified: N; VDC_V: 75V; AEC Category: Q200; SizeAreaWB_mm2: 4.68; ComponentLink1URL: http://www.yageo.com/pdf/Pu-RC0603_51_PbFree_L_2.pdf; Supplier Part Number 2: 603-RC0603FR-07768KL; Supplier 2: Mouser; Value_Code: 768k; RoHS: Y; Value1: 1%; MountType: SMT; Supplier 1: Digi-Key; PackageReference: 0603; Tolerance_%: 1%; Res_ohm: 768k; CompType: Resistor; PartNumber: RC0603FR-07768KL; ComponentLink1Description: Datasheet link; Supplier Part Number 1: 311-768KHRCT-ND; Technology: Thick Film; AEC Grade: N/A
R13 = CMP-0022735-5: RES, 100 k, 1%, 0.1 W, 0603; Manufacturer: Yageo; Power_W: 100mW; TempCo: 100 ppm/C; Value: 100k; EIA_Code: E96; SizeX_mm: 1.6; SizeY_mm: 0.8; SizeZ_mm: 1; Value2: 0.1W; SizeArea_mm2: 1.28; AEC Qualified: N; VDC_V: 75V; AEC Category: Q200; SizeAreaWB_mm2: 4.68; Supplier Part Number 2: 603-RC0603FR-07100KL; Supplier 2: Mouser; Supplier Part Number 3: 9238727; Supplier 3: Farnell; Value_Code: 100k; RoHS: Y; Value1: 1%; MountType: SMT; Supplier 1: Digi-Key; PackageReference: 0603; Tolerance_%: 1%; Res_ohm: 100k; CompType: Resistor; PartNumber: RC0603FR-07100KL; ComponentLink1Description: Datasheet link; Supplier Part Number 1: 311-100KHRCT-ND; Technology: Thick Film; ComponentLink1URL: http://www.yageo.com/pdf/Pu-RC0603_51_PbFree_L_2.pdf; AEC Grade: N/A
R14 = CMP-0026721-1: RES, 100 k, 1%, 0.0625 W, 0402; Manufacturer: Yageo America; Power_W: 62.5mW; TempCo: 100 ppm/C; U/M: EA; Value: 100k; EIA_Code: E96; SizeX_mm: 1; SizeY_mm: 0.5; SizeZ_mm: 0.6; AEC Qualified: N; VDC_V: 50V; AEC Category: Q200; ComponentLink1URL: http://www.yageo.com/documents/recent/PYu-RC0402_51_RoHS_L_6_r.pdf; Supplier Part Number 2: 67R9887; Publisher: Texas Instruments; Supplier 2: Newark; Supplier Part Number 3: 603-RC0402FR-07100KL; Supplier 3: Mouser; Published: 2008-06-26; Value_Code: 100k; RoHS: Y; Value1: 1%; MountType: SMT; Supplier 1: Digi-Key; PackageReference: 0402; Tolerance_%: 1%; Res_ohm: 100k; Value2: 0.0625W; SizeArea_mm2: 0.5; CompType: Resistor; LatestRevisionDate: 2017-03-09; PartNumber: RC0402FR-07100KL; ComponentLink1Description: Datasheet link; AEC Grade: N/A; Supplier Part Number 1: 311-100KLRCT-ND; Technology: Thick Film
R100 R101 = CMP-0078781-1: RES, 10.5 k, 1%, 0.063 W, 0402; Manufacturer: Yageo America; Value_Code: 10k5; SizeArea_mm2: 0.5; AEC Qualified: N; AEC Category: Q200; Value: 10.5k; SizeZ_mm: 0.6; EIA_Code: E96; TempCo: 100 ppm/C; Power_W: 63mW; VDC_V: 50V; Value2: 0.063W; SizeX_mm: 1; ComponentLink1Description: Datasheet link; RoHS: Y; Supplier Part Number 3: 603-RC0402FR-0710K5L; Tolerance_%: 1%; Supplier 1: Digi-Key; PackageReference: 0402; Technology: Thick Film; Res_ohm: 10.5k; PartNumber: RC0402FR-0710K5L; Supplier Part Number 2: 66R1118; Supplier 2: Newark; AEC Grade: N/A; SizeY_mm: 0.5; ComponentLink1URL: http://www.yageo.com/documents/recent/PYu-RC_Group_51_RoHS_L_8.pdf; Value1: 1%; CompType: Resistor; MountType: SMT; Supplier Part Number 1: YAG2951CT-ND; Supplier 3: Mouser
TP1-TP3 = CMP-0003968-1: Test Point, SMT; Manufacturer: Harwin; ComponentLink1URL: https://cdn.harwin.com/pdfs/S2751R.pdf; Key: S2751-46R; Publisher: Texas Instruments; Supplier Part Number 2: 76Y5390; Supplier 3: Mouser; Supplier 1: Digi-Key; CompType: Test Point; PackageReference: Test Point, SMT; LatestRevisionDate: 2017-03-09; RoHS: Y; Supplier Part Number 1: 952-2664-1-ND; Supplier Part Number 3: 855-S2751-46R; Supplier 2: Newark; MountType: SMT; PartNumber: S2751-46R; ComponentLink1Description: Datasheet Link
U1 U2 = CMP-0013424-7: 33-V Precision Surge Protection Clamp, DRV0006A (WSON-6); Manufacturer: Texas Instruments; Alternate PartNumber: TVS3300DRVT; SizeX_mm: 2; CompType: IC; SizeZ_mm: 0.8; SizeArea_mm2: 4; SizeAreaWB_mm2: 9; U/M: EA; PackageDescription: WSON-6; PartNumber: TVS3300DRVR; ComponentLink1URL: http://www.ti.com/lit/ds/symlink/tvs3300.pdf; ComponentLink1Description: Datasheet Link; SizeY_mm: 2; RoHS: Y; PackageReference: DRV0006A; MountType: SMT; Alternate Manufacturer: Texas Instruments; ComponentLink2Description: Product Folder; ComponentLink2URL: http://www.ti.com/product/tvs3300; Supplier Part Number 1: 296-47565-1-ND; Supplier 1: Digi-Key
U3 = CMP-0120692-1: 100-V, 53-A GaN Half-Bridge Power Stage; Manufacturer: Texas Instruments; SizeZ_mm: 0.85mm; AEC Qualified: No; Max Supply Voltage: 5.25V; Min Supply Voltage: 4.75V; Nominal Supply Current: 12mA; Number Of Outputs: 1; Standoff Height: 0mm; TJmax_C: +125°C; PackageReference: VQFN-FCRLF16; PartNumber: LMG2100R026; RoHS: UNKNOWN; Operating Temperature Range: -40°C to +125°C; Part Number: LMG2100R026; Datasheet Path: datasheets/IC-LMG2100R026.pdf; helpURL: https://upverter.com/upn/revision/6cbafed2923246a8/
U4 U5 = CMP-0066947-1: 4A/4A Single Channel High-speed Low-side Gate Driver, DBV0005A (SOT-23-5); Alternate PartNumber: UCC27517DBVT; Alternate Manufacturer: Texas Instruments; Green_Lifecycle: Active; SizeAreaWB_mm2: 14.82; Green_REACh: Passed; U/M: EA; SizeZ_mm: 1.45; SizeX_mm: 2.8; SizeY_mm: 2.9; SizeArea_mm2: 8.12; CompType: IC; ComponentLink1URL: http://www.ti.com/lit/ds/symlink/ucc27517.pdf; Publisher: Texas Instruments; PackageDescription: SOT-23-5; RoHS: Y; Footprint Path 6: C:\AltiumLibraries\Footprints\TI\.PcbLib; MountType: SMT; Green_EU RoHS-2: Passed; Manufacturer: Texas Instruments; Green_EU RoHS: Passed; PackageReference: DBV0005A; LatestRevisionDate: 2017-06-09; PartNumber: UCC27517DBVR; ComponentLink1Description: Datasheet Link; Supplier Part Number 1: 296-36899-1-ND; Supplier 1: Digi-Key
U6 = CMP-0098344-1: 3-V to 65-V Input, 1-V to 13-V Output, 600-mA Synchronous Buck Converter Power Module in a HotRod QFN Package; Manufacturer: Texas Instruments; SizeZ_mm: 2.1mm; AEC Qualified: No; Max Duty Cycle: 98%; Max Supply Voltage: 65V; Min Supply Voltage: 3.6V; Number Of Outputs: 1; Output Type: Fixed; Output Voltage: 5V; Standoff Height: 0mm; Switching Frequency: 1MHz; TJmax_C: +125°C; PackageReference: VQFN-HR9; PartNumber: TPSM365R6V5RDNR; RoHS: UNKNOWN; Operating Temperature Range: -40°C to +125°C; Part Number: TPSM365R6V5RDNR; Datasheet Path: datasheets/IC-TPSM365R6V5RDNR.pdf; helpURL: https://upverter.com/upn/revision/143b1aaee536e889/; Switching Topology: Buck
U7 = CMP-0092532-1: 300-mA, Ultra-Low-Noise, Low-IQ, High PSRR LDO; Manufacturer: Texas Instruments; TJmax_C: +125°C; Min Supply Voltage: 1.6V; SizeZ_mm: 1.45mm; Output Voltage: 3.3V; Number Of Outputs: 1; Nominal Supply Current: 6.5uA; AEC Qualified: No; Accuracy Percentage: 1.5%; Max Supply Voltage: 6V; Dropout Voltage: 145mV; Standoff Height: 0mm; Output Type: Fixed; Datasheet Path: datasheets/IC-TPS7A2033PDBVR.pdf; Lead Free: Yes; ComponentLink1Description: Datasheet; PackageReference: SOT23-5; ComponentLink1URL: https://www.ti.com/lit/ds/symlink/tps7a20.pdf; Digikey Description: IC REG LINEAR 3.3V 300MA SOT23-5; Digikey Part Number: 296-TPS7A2033PDBVRCT-ND; Part Number: TPS7A2033PDBVR; Mouser Description: 300-mA, ultra-low-noise, low-IQ, low-dropout (LDO) linear regulator with high PSRR 5-SOT-23 -40 to 125; helpURL: https://upverter.com/upn/revision/b1390149dc24e97c/; Operating Temperature Range: -40°C to +125°C; datasheet: https://www.ti.com/lit/ds/symlink/tps7a20.pdf; PartNumber: TPS7A2033PDBVR; Mouser Part Number: 595-TPS7A2033PDBVR; RoHS: TRUE